# EAGLE design ManitoBoardLP1 (EAGLE 7.2.0)
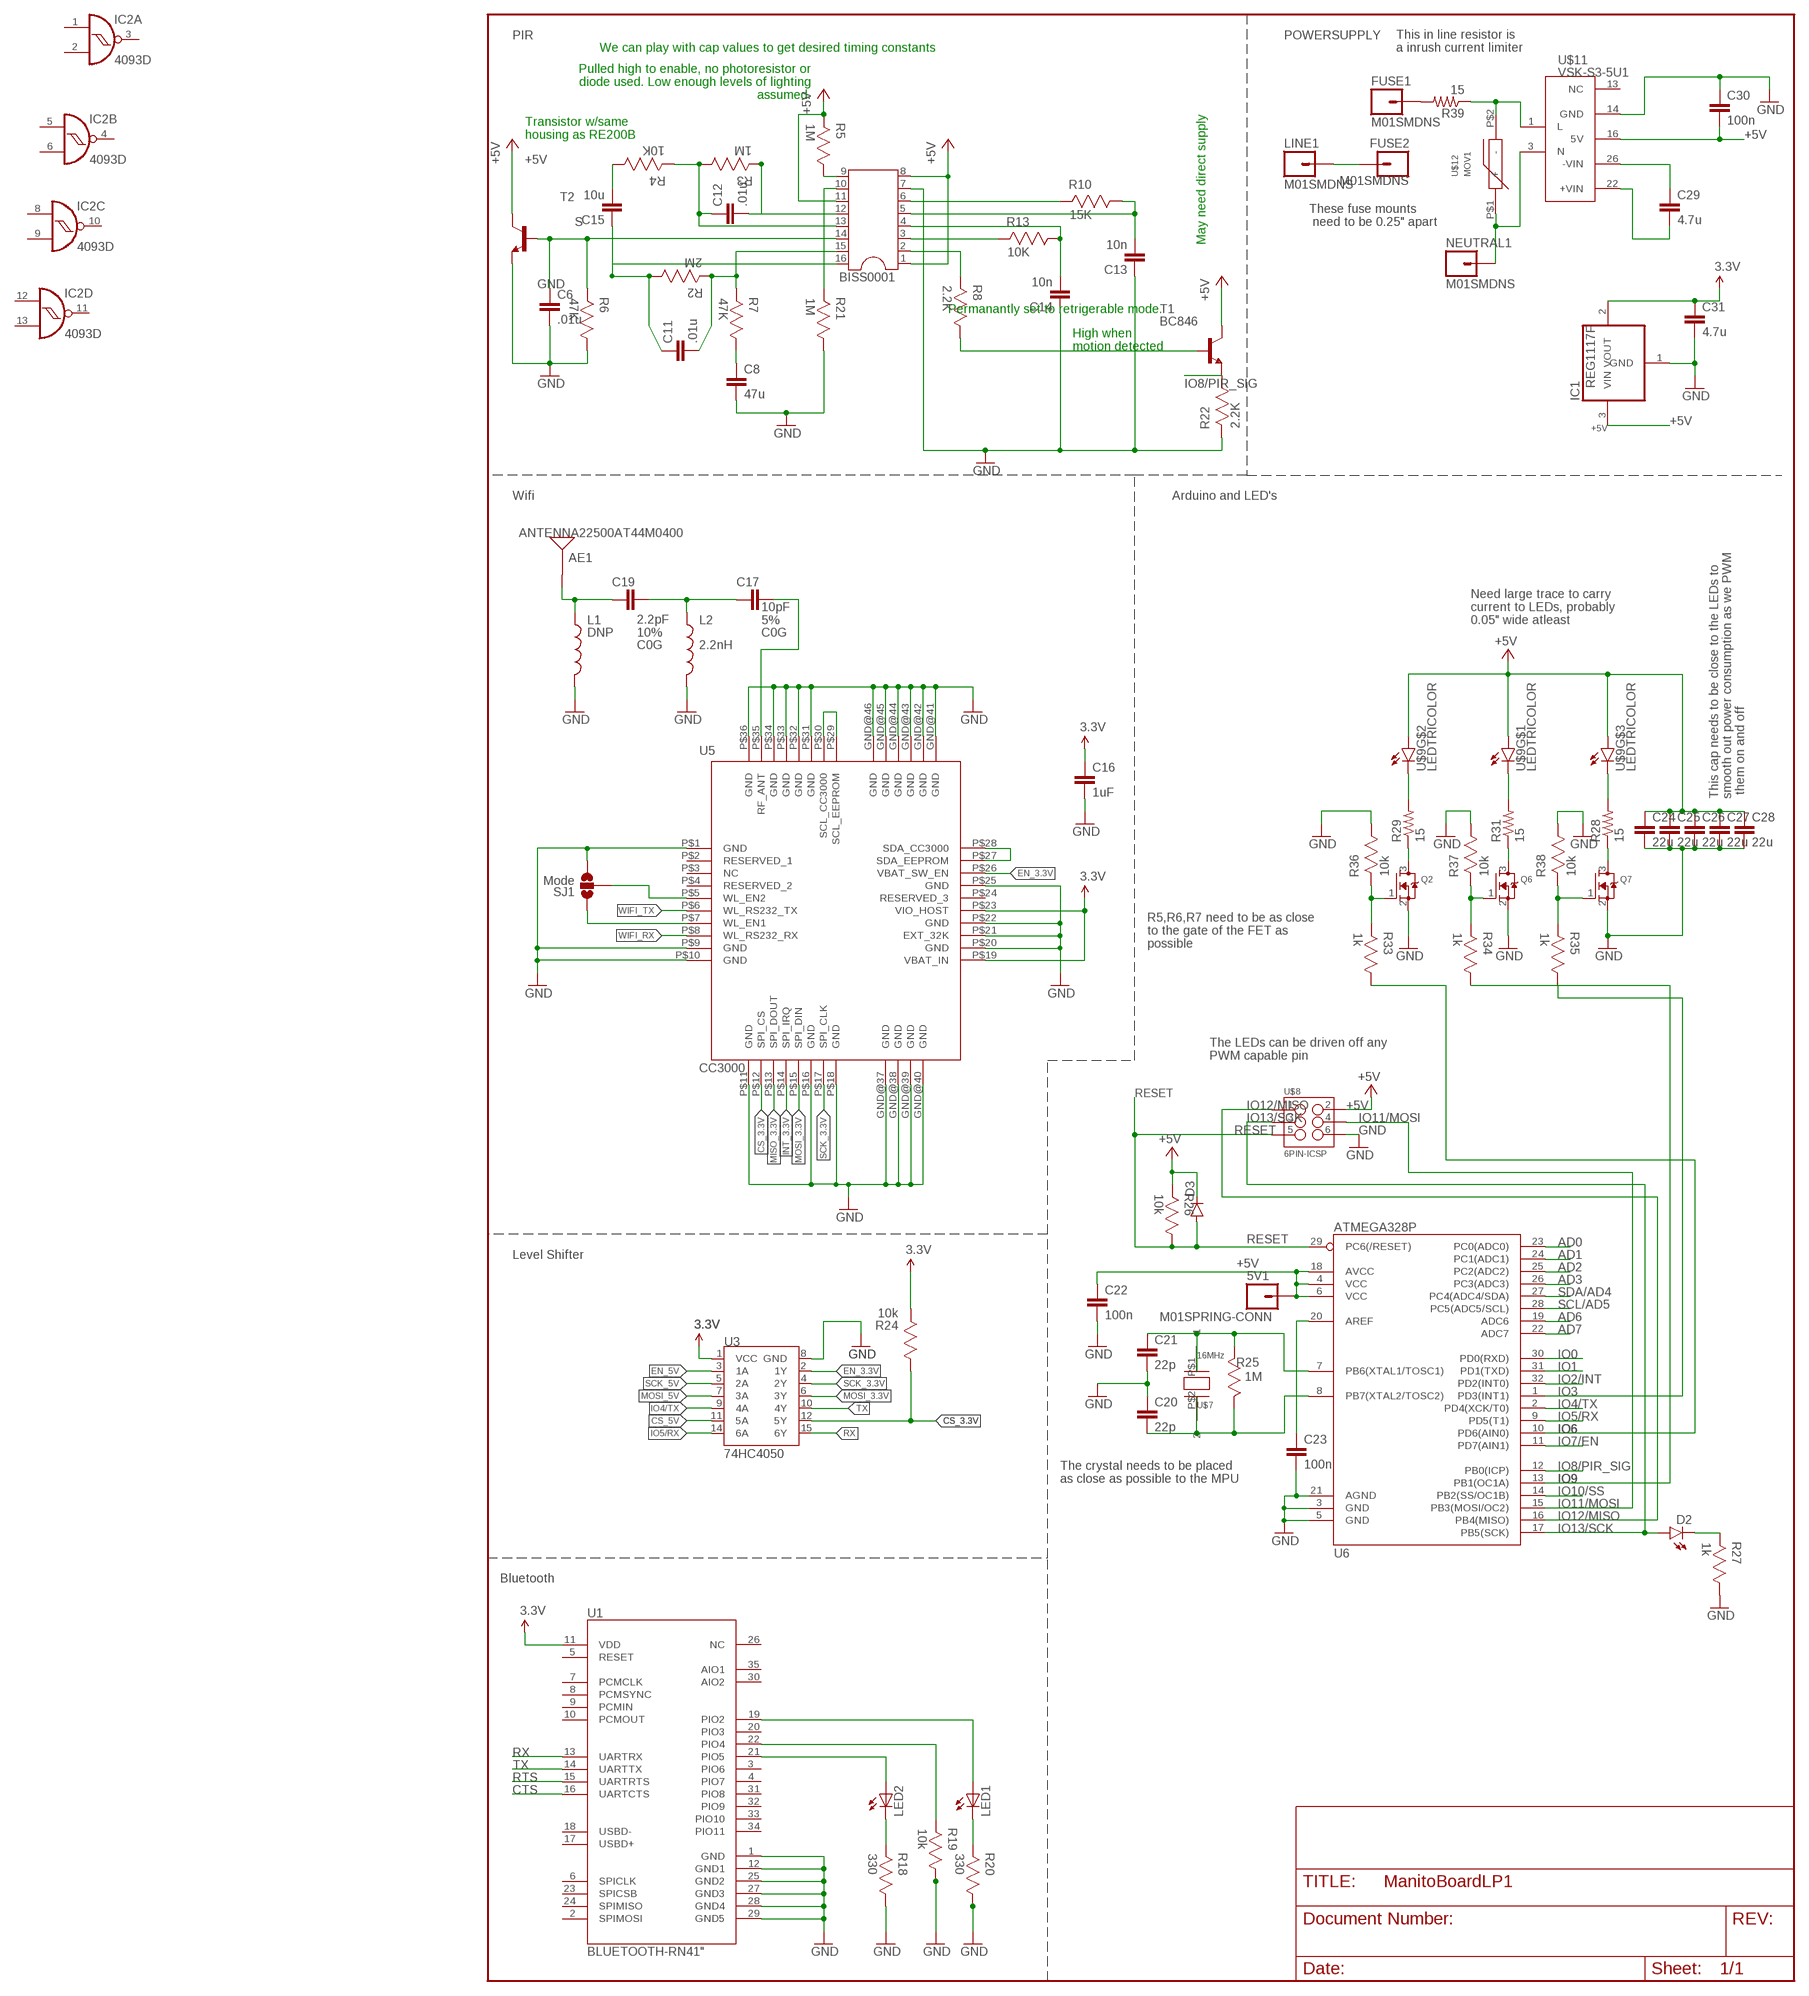
[diagram p0: schematic, sheet 1]

## Parts
5V1  M01SPRING-CONN  [SPRING-CONNECTOR]
AE1  ANTENNA22500AT44M0400  [ANTENNA-CHIP_2500AT44M0400]
BISS0001  DIL16S  [SOCKET-16]
C6  .01u  CAP0805  [0805]
C8  47u  CAP0805  [0805]
C11  .01u  CAP0805  [0805]
C12  .01u  CAP0805  [0805]
C13  10n  CAP0805  [0805]
C14  10n  CAP0805  [0805]
C15  10u  CAP0805  [0805]
C16  1uF  CAP0805  [0805]
C17  10pF  CAP0603-CAP  [0603-CAP]
C19  2.2pF  CAP0603-CAP  [0603-CAP]
C20  22p  CAP0603-CAP  [0603-CAP]
C21  22p  CAP0603-CAP  [0603-CAP]
C22  100n  CAP0603-CAP  [0603-CAP]
C23  100n  CAP0603-CAP  [0603-CAP]
C24  22u  CAP0603-CAP  [0603-CAP]
C25  22u  CAP0603-CAP  [0603-CAP]
C26  22u  CAP0603-CAP  [0603-CAP]
C27  22u  CAP0603-CAP  [0603-CAP]
C28  22u  CAP0603-CAP  [0603-CAP]
C29  4.7u  CAP0603-CAP  [0603-CAP]
C30  100n  CAP0603-CAP  [0603-CAP]
C31  4.7u  CAP0603-CAP  [0603-CAP]
D2  LED-YELLOW0603  [LED-0603]
D3  DIODE1N4148  [DIODE-1N4148]
FUSE1  M01SMDNS  [1X01NS]
FUSE2  M01SMDNS  [1X01NS]
IC1  REG1117F  [DD-3]
IC2  4093D  [SO14]
L1  DNP  INDUCTOR0603  [0603]
L2  2.2nH  INDUCTOR0603  [0603]
LED1  LED_ESML0603  [LED_SML0603]
LED2  LED_ESML0603  [LED_SML0603]
LINE1  M01SMDNS  [1X01NS]
NEUTRAL1  M01SMDNS  [1X01NS]
Q2  MOSFET-NREFLOW  [SOT23]
Q6  MOSFET-NREFLOW  [SOT23]
Q7  MOSFET-NREFLOW  [SOT23]
R2  2M  0603RESISTOR1  [0603RESISTOR]
R3  1M  0603RESISTOR1  [0603RESISTOR]
R4  10K  0603RESISTOR1  [0603RESISTOR]
R5  1M  0603RESISTOR1  [0603RESISTOR]
R6  47K  0603RESISTOR1  [0603RESISTOR]
R7  47K  0603RESISTOR1  [0603RESISTOR]
R8  2.2K  0603RESISTOR1  [0603RESISTOR]
R10  15K  0603RESISTOR1  [0603RESISTOR]
R13  10K  0603RESISTOR1  [0603RESISTOR]
R18  330  0603RESISTOR1  [0603RESISTOR]
R19  10k  0603RESISTOR1  [0603RESISTOR]
R20  330  0603RESISTOR1  [0603RESISTOR]
R21  1M  0603RESISTOR1  [0603RESISTOR]
R22  2.2K  0603RESISTOR1  [0603RESISTOR]
R24  10k  0603RESISTOR1  [0603RESISTOR]
R25  1M  0603RESISTOR1  [0603RESISTOR]
R26  10k  0603RESISTOR1  [0603RESISTOR]
R27  1k  0603RESISTOR1  [0603RESISTOR]
R28  15  RESISTORPTH-1W  [AXIAL-0.6]
R29  15  RESISTORPTH-1W  [AXIAL-0.6]
R31  15  RESISTORPTH-1W  [AXIAL-0.6]
R33  1k  0603RESISTOR1  [0603RESISTOR]
R34  1k  0603RESISTOR1  [0603RESISTOR]
R35  1k  0603RESISTOR1  [0603RESISTOR]
R36  10k  0603RESISTOR1  [0603RESISTOR]
R37  10k  0603RESISTOR1  [0603RESISTOR]
R38  10k  0603RESISTOR1  [0603RESISTOR]
R39  15  RESISTORPTH-1W  [AXIAL-0.6]
SJ1  Mode  SOLDERJUMPER_2WAYPASTE1&2  [SJ_3_PASTE1&2]
T1  BC846  [SOT23]
T2  -NPN-TO5  [TO5]
U1  BLUETOOTH-RN41"  [RN41]
U3  74HC4050  HEX_CONVERTER  [SO016]
U5  CC3000  [QFN-46_CC3000]
U6  ATMEGA328P  ATMEGA328_SMT  [TQFP32-08]
U$7  16MHz  SMDCRYSTAL  [SMDCRYSTAL]
U$8  6PIN-ICSP  [2X3-ICSP]
U$9  LEDTRICOLOR  [TRICOLORLED]
U$11  VSK-S3-5U1  [VSK-S3-DCAC]
U$12  MOV1  [MOV]

## Nets
3.3V: C16.1 C31.1 IC1.2(VOUT) R24.2 U1.11(VDD) U3.1(VCC) U5.P$19(VBAT_IN) U5.P$23(VIO_HOST)
+5V [usbvcc]: 5V1.P$2 BISS0001.1 BISS0001.8 BISS0001.11 C22.1 C24.1 C25.1 C26.1 C27.1 C28.1 C30.2 D3.C IC1.3(VIN) R5.2 R26.2 T1.3(C) T2.3(C) U6.4(VCC) U6.6(VCC) U6.18(AVCC) U$8.2(+5V) U$9.A1(A) U$9.A2(A) U$9.A3(A) U$11.16(5V)
AD0: U6.23(PC0(ADC0))
AD1: U6.24(PC1(ADC1))
AD2: U6.25(PC2(ADC2))
AD3: U6.26(PC3(ADC3))
AD6: U6.19(ADC6)
AD7: U6.22(ADC7)
CS_3.3V: R24.1 U3.12(5Y) U5.P$12(SPI_CS)
CS_5V: U3.11(5A)
CTS: U1.16(UARTCTS)
EN_3.3V: U3.2(1Y) U5.P$26(VBAT_SW_EN)
EN_5V: U3.3(1A)
GND: BISS0001.7 C6.2 C8.2 C13.1 C14.1 C16.2 C20.1 C21.2 C22.2 C23.2 C24.2 C25.2 C26.2 C27.2 C28.2 C30.1 C31.2 IC1.1(GND) L1.2 L2.2 Q2.2(S) Q6.2(S) Q7.2(S) R6.1 R18.1 R19.1 R20.1 R21.1 R22.2 R27.1 R36.1 R37.1 R38.1 SJ1.3 T2.1(E) U1.1(GND) U1.12(GND1) U1.25(GND2) U1.27(GND3) U1.28(GND4) U1.29(GND5) U3.8(GND) U5.GND@37(GND) U5.GND@38(GND) U5.GND@39(GND) U5.GND@40(GND) U5.GND@41(GND) U5.GND@42(GND) U5.GND@43(GND) U5.GND@44(GND) U5.GND@45(GND) U5.GND@46(GND) U5.P$1(GND) U5.P$9(GND) U5.P$10(GND) U5.P$11(GND) U5.P$16(GND) U5.P$18(GND) U5.P$20(GND) U5.P$21(EXT_32K) U5.P$22(GND) U5.P$25(GND) U5.P$31(GND) U5.P$32(GND) U5.P$33(GND) U5.P$34(GND) U5.P$36(GND) U6.3(GND) U6.5(GND) U6.21(AGND) U$8.6(GND) U$11.14(GND)
INT_3.3V: U5.P$14(SPI_IRQ)
IO0: U6.30(PD0(RXD))
IO1: U6.31(PD1(TXD))
IO2/INT: U6.32(PD2(INT0))
IO3: R35.1 U6.1(PD3(INT1))
IO4/TX: U3.9(4A) U6.2(PD4(XCK/T0))
IO5/RX: U3.14(6A) U6.9(PD5(T1))
IO6: R33.1 U6.10(PD6(AIN0))
IO7/EN: U6.11(PD7(AIN1))
IO8/PIR_SIG: R22.1 T1.2(E) U6.12(PB0(ICP))
IO9: R34.1 U6.13(PB1(OC1A))
IO10/SS: U6.14(PB2(SS/OC1B))
IO11/MOSI: U6.15(PB3(MOSI/OC2)) U$8.4(MOSI)
IO12/MISO: U6.16(PB4(MISO)) U$8.1(MISO)
IO13/SCK: D2.A U6.17(PB5(SCK)) U$8.3(SCK)
MISO_3.3V: U5.P$13(SPI_DOUT)
MOSI_3.3V: U3.6(3Y) U5.P$15(SPI_DIN)
MOSI_5V: U3.7(3A)
N$1: BISS0001.9 R5.1
N$3: LED2.C R18.2
N$14: BISS0001.16 C11.1 C15.1 R2.1
N$15: BISS0001.15 C11.2 R2.2 R7.2
N$16: BISS0001.13 C12.1 R3.1 R4.2
N$20: LED1.C R20.2
N$26: BISS0001.12 C12.2 R3.2
N$27: C8.1 R7.1
N$32: LED2.A U1.21(PIO5)
N$33: R19.2 U1.22(PIO4)
N$34: LED1.A U1.19(PIO2)
N$35: BISS0001.10 R21.2
N$36: C15.2 R4.1
N$37: BISS0001.6 R10.2
N$38: BISS0001.5 C13.2 R10.1
N$39: BISS0001.4 C14.2 R13.1
N$40: BISS0001.3 R13.2
N$41: BISS0001.2 R8.2
N$42: R8.1 T1.1(B)
N$43: SJ1.2 U5.P$5(WL_EN2)
N$44: SJ1.1 U5.P$7(WL_EN1)
N$45: U5.P$27(SDA_EEPROM) U5.P$28(SDA_CC3000)
N$46: U5.P$29(SCL_EEPROM) U5.P$30(SCL_CC3000)
N$47: C17.1 C19.2 L2.1
N$48: AE1.FEED(SIGNAL) C19.1 L1.1
N$50: C17.2 U5.P$35(RF_ANT)
N$53: C20.2 R25.1 U6.8(PB7(XTAL2/TOSC2)) U$7.P$2
N$54: C21.1 R25.2 U6.7(PB6(XTAL1/TOSC1)) U$7.P$1
N$55: C23.1 U6.20(AREF)
N$56: D2.C R27.2
N$57: R29.P$2 U$9.C2(C)
N$58: R31.P$2 U$9.C1(C)
N$59: R28.P$2 U$9.C3(C)
N$60: Q7.3(D) R28.P$1
N$61: Q6.3(D) R31.P$1
N$62: Q2.3(D) R29.P$1
N$63: Q2.1(G) R33.2 R36.2
N$64: Q7.1(G) R35.2 R38.2
N$65: Q6.1(G) R34.2 R37.2
N$68: C29.1 U$11.26(-VIN)
N$69: C29.2 U$11.22(+VIN)
N$70: R39.P$1 U$11.1(L) U$12.P$2(-)
N$71: NEUTRAL1.1 U$11.3(N) U$12.P$1(+)
N$72: FUSE2.1 LINE1.1
N$73: FUSE1.1 R39.P$2
RESET: D3.A R26.1 U6.29(PC6(/RESET)) U$8.5(RESET)
RTS: U1.15(UARTRTS)
RX: U1.13(UARTRX) U3.15(6Y)
S: BISS0001.14 C6.1 R6.2 T2.2(B)
SCK_3.3V: U3.4(2Y) U5.P$17(SPI_CLK)
SCK_5V: U3.5(2A)
SCL/AD5: U6.28(PC5(ADC5/SCL))
SDA/AD4: U6.27(PC4(ADC4/SDA))
TX: U1.14(UARTTX) U3.10(4Y)
WIFI_RX: U5.P$8(WL_RS232_RX)
WIFI_TX: U5.P$6(WL_RS232_TX)
Unconnected: IC2.1(A:I0) IC2.2(A:I1) IC2.3(A:O) IC2.4(B:O) IC2.5(B:I0) IC2.6(B:I1) IC2.8(C:I0) IC2.9(C:I1) IC2.10(C:O) IC2.11(D:O) IC2.12(D:I0) IC2.13(D:I1) U1.2(SPIMOSI) U1.3(PIO6) U1.4(PIO7) U1.5(RESET) U1.6(SPICLK) U1.7(PCMCLK) U1.8(PCMSYNC) U1.9(PCMIN) U1.10(PCMOUT) U1.17(USBD+) U1.18(USBD-) U1.20(PIO3) U1.23(SPICSB) U1.24(SPIMISO) U1.26(NC) U1.30(AIO2) U1.31(PIO8) U1.32(PIO9) U1.33(PIO10) U1.34(PIO11) U1.35(AIO1) U5.P$2(RESERVED_1) U5.P$3(NC) U5.P$4(RESERVED_2) U5.P$24(RESERVED_3) U$11.13(NC)

## Notes on the sheet
- PIR
- We can play with cap values to get desired timing constants
- This in line resistor is 
  a inrush current limiter
- Pulled high to enable, no photoresistor or
   diode used. Low enough levels of lighting
   assumed.
- May need direct supply
- Transistor w/same 
  housing as RE200B
- These fuse mounts
   need to be 0.25" apart
- Permanantly set to retrigerable mode.
- High when 
  motion detected
- Wifi | Arduino and LED's
- Need large trace to carry
  current to LEDs, probably
  0.05" wide atleast
- This cap needs to be close to the LEDs to 
  smooth out power consumption as we PWM
   them on and off
- R5,R6,R7 need to be as close
  to the gate of the FET as
  possible
- The LEDs can be driven off any
  PWM capable pin
- Level Shifter
- The crystal needs to be placed
  as close as possible to the MPU
- Bluetooth

## Power pins joined to a net without a drawn wire
VDD: IC2.14(P:VDD)
VSS: IC2.7(P:VSS)

## Library data of the parts
5V1 FUSE1 FUSE2 LINE1 NEUTRAL1 = CharlieCreations:M01: Header 1 Standard 1-pin 0.1" header. Use with straight break away headers (SKU : PRT-00116), right angle break away headers (PRT-00553), swiss pins (PRT-00743), machine pins (PRT-00117), and female headers (PRT-00115).
AE1 = SparkFun-RF:ANTENNA2: Chip antenna Single endded antenna. Common with smaller chip antennas. CHIP4 package is the GPS Chip Antenna SKU: GPS-08418. CHIP5 package is 2.4GHz chip antenna SKU: WRL-00144.
BISS0001 = ic-package:DIL16: Dual In Line / Socket
C6 C8 C11-C15 C20-C31 = CharlieCreations:CAP: Capacitor Standard 0603 ceramic capacitor, and 0.1" leaded capacitor.
C16 = SparkFun-Capacitors:CAP: Capacitor Standard 0603 ceramic capacitor, and 0.1" leaded capacitor.
C17 = SparkFun-Capacitors:CAP: Capacitor Standard 0603 ceramic capacitor, and 0.1" leaded capacitor.; COEFF: C0G; TOL: 5%
C19 = SparkFun-Capacitors:CAP: Capacitor Standard 0603 ceramic capacitor, and 0.1" leaded capacitor.; COEFF: C0G; TOL: 10%
D2 = CharlieCreations:LED-YELLOW: Yellow SMD LEDs LilyPad 1206- DIO-09909 0603- DIO-09003; PROD_ID: DIO-09003
D3 = CharlieCreations:DIODE: Diode These are standard reverse protection diodes and small signal diodes. SMA package can handle up to about 1A. SOD-323 can handle about 200mA. What the SOD-323 package when ordering, there are some mfgs out there that are 5-pin packages.
IC1 = burr-brown:REG1117: 800mA and 1A Low Dropout (LDO) Positive Regulator 1.8V, 2.5V, 2.85V, 3.3V, 5V, and Adj; MF: TEXAS INSTRUMENTS; MPN: REG1117FAKTTT; OC_FARNELL: 1296120; OC_NEWARK: 87H2562
IC2 = adafruit:4093: Quad 2-input NAND schmitt trigger
L1 L2 = SparkFun-Passives:INDUCTOR: Inductors Basic Inductor/Choke - 0603 and 1206. Footprints are not proven and vary greatly between part numbers. SRN6045- 33uH, 20% 1.4A
LED1 LED2 = eagle-ltspice:LED_E: LED Source: http://www.osram.convergy.de Source: www.luxeon.com Source: www.kingbright.com; SPICEMODEL: NONE; SPICEPREFIX: D; SPICETYPE: diode
Q2 Q6 Q7 = CharlieCreations:MOSFET-N: N-Channel Mosfet 2N7002E - 60V 260mA SOT23 [Digikey: 2N7002ET1GOSTR-ND] - REEL BSH103 - 30V 850mA SOT23 [Digikey: 568-5013-1-ND]
R2-R8 R10 R13 R18-R22 R24-R27 R33-R38 = CharlieCreations:0603RESISTOR: RESISTOR, 0603; MPN: CRCW06031K21FKEA; OC_FARNELL: 1652852; OC_NEWARK: 52K8027; SUPPLIER: Vishay; TOLERANCE: ± 1.0 %; VALUE: 0; WATTAGE: 0.1W
R28 R29 R31 R39 = SparkFun-Passives:RESISTOR: Resistor Basic schematic elements and footprints for 0603, 1206, and PTH resistors.
SJ1 = SparkFun-Passives:SOLDERJUMPER_2WAY: Solder Jumper 2 way solder jumper
T1 = CharlieCreations:BC846: NPN TRANSISTOR
T2 = transistor:*-NPN-: NPN Transistror BF959 corrected 2008.03.06
U1 = SparkFun:BLUETOOTH-RN41
U3 = SparkFun-DigitalIC:HEX_CONVERTER: Just what it says.
U5 = SparkFun-RF:CC3000: TI CC3000 WiFi Module
U6 = CharlieCreations:ATMEGA328_SMT: 32-Pin Atmega328 part Commonly used on Arduino compatible boards Available in QFP and QFN packages TQFP is IC-09069 QFN is non-stock; PROD_ID: IC-09069
U$7 = CharlieCreations:SMDCRYSTAL
U$8 = CharlieCreations:6PIN-ICSP
U$9 = CharlieCreations:LEDTRICOLOR
U$11 = CharlieCreations:VSK-S3-5U: Universal AC to DC adapter, 5V Output, Manufacturer: CUI Inc
U$12 = CharlieCreations:MOV

## Net classes
2 gnd: width 0.305 mm, drill 0.559 mm, clearance 0.254 mm
3 usbvcc: width 0.508 mm, drill 0.61 mm, clearance 0.254 mm

## Board
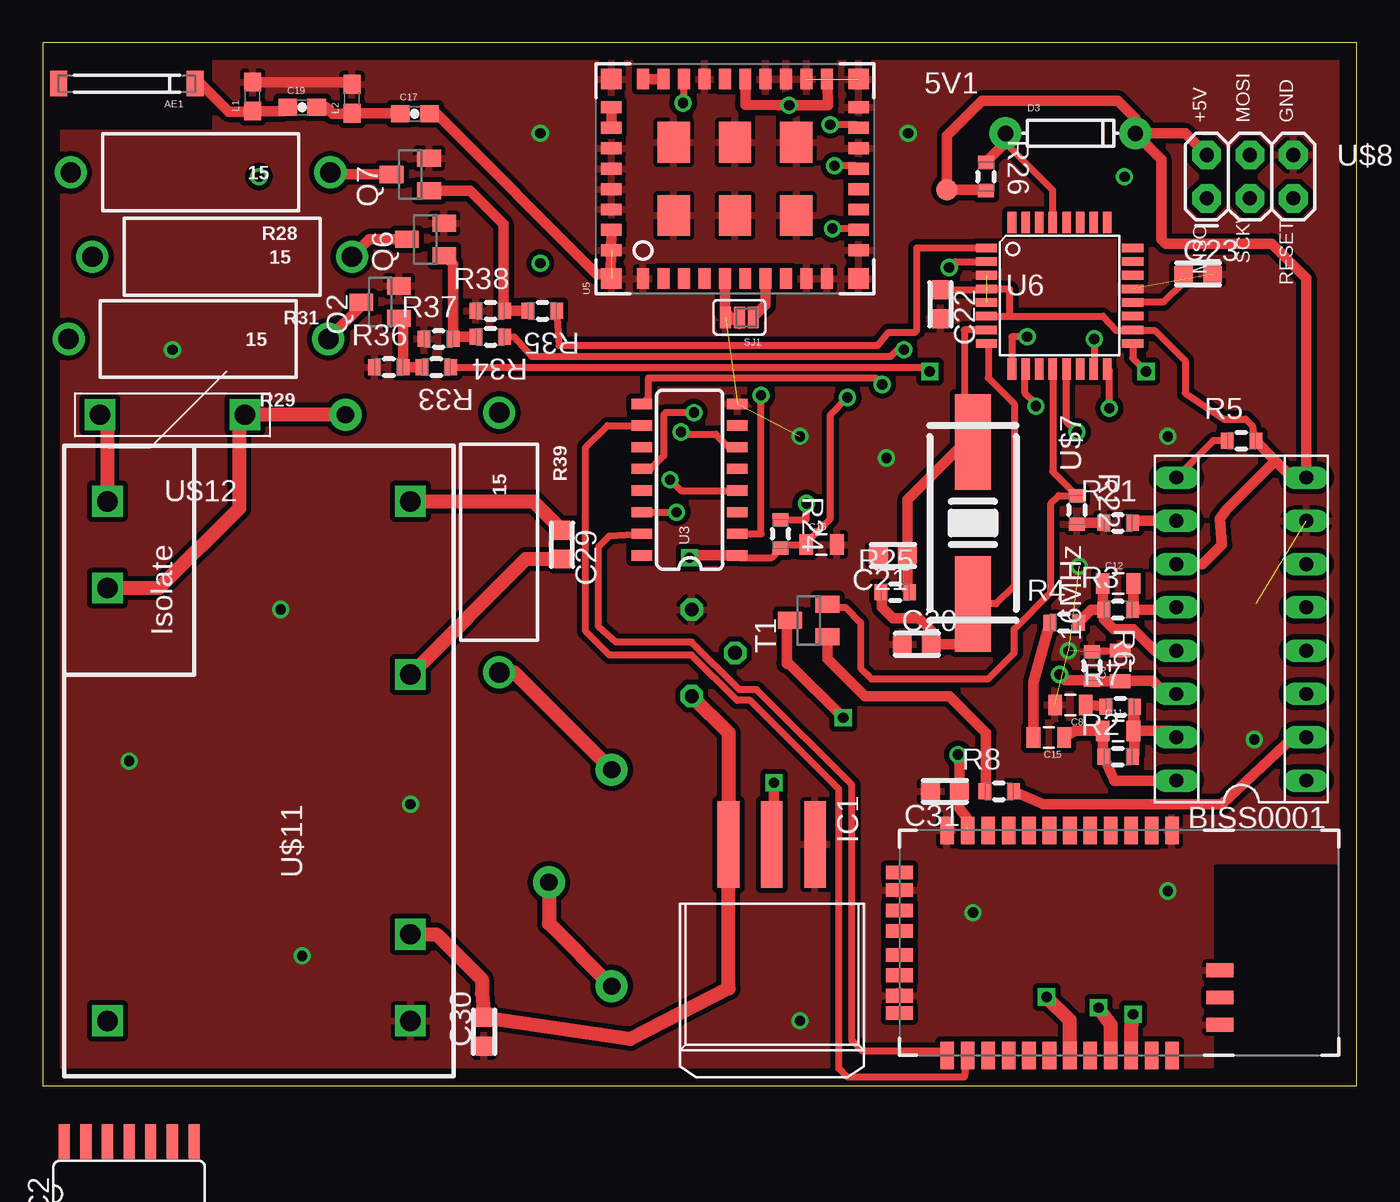
[diagram p1: board, top side]
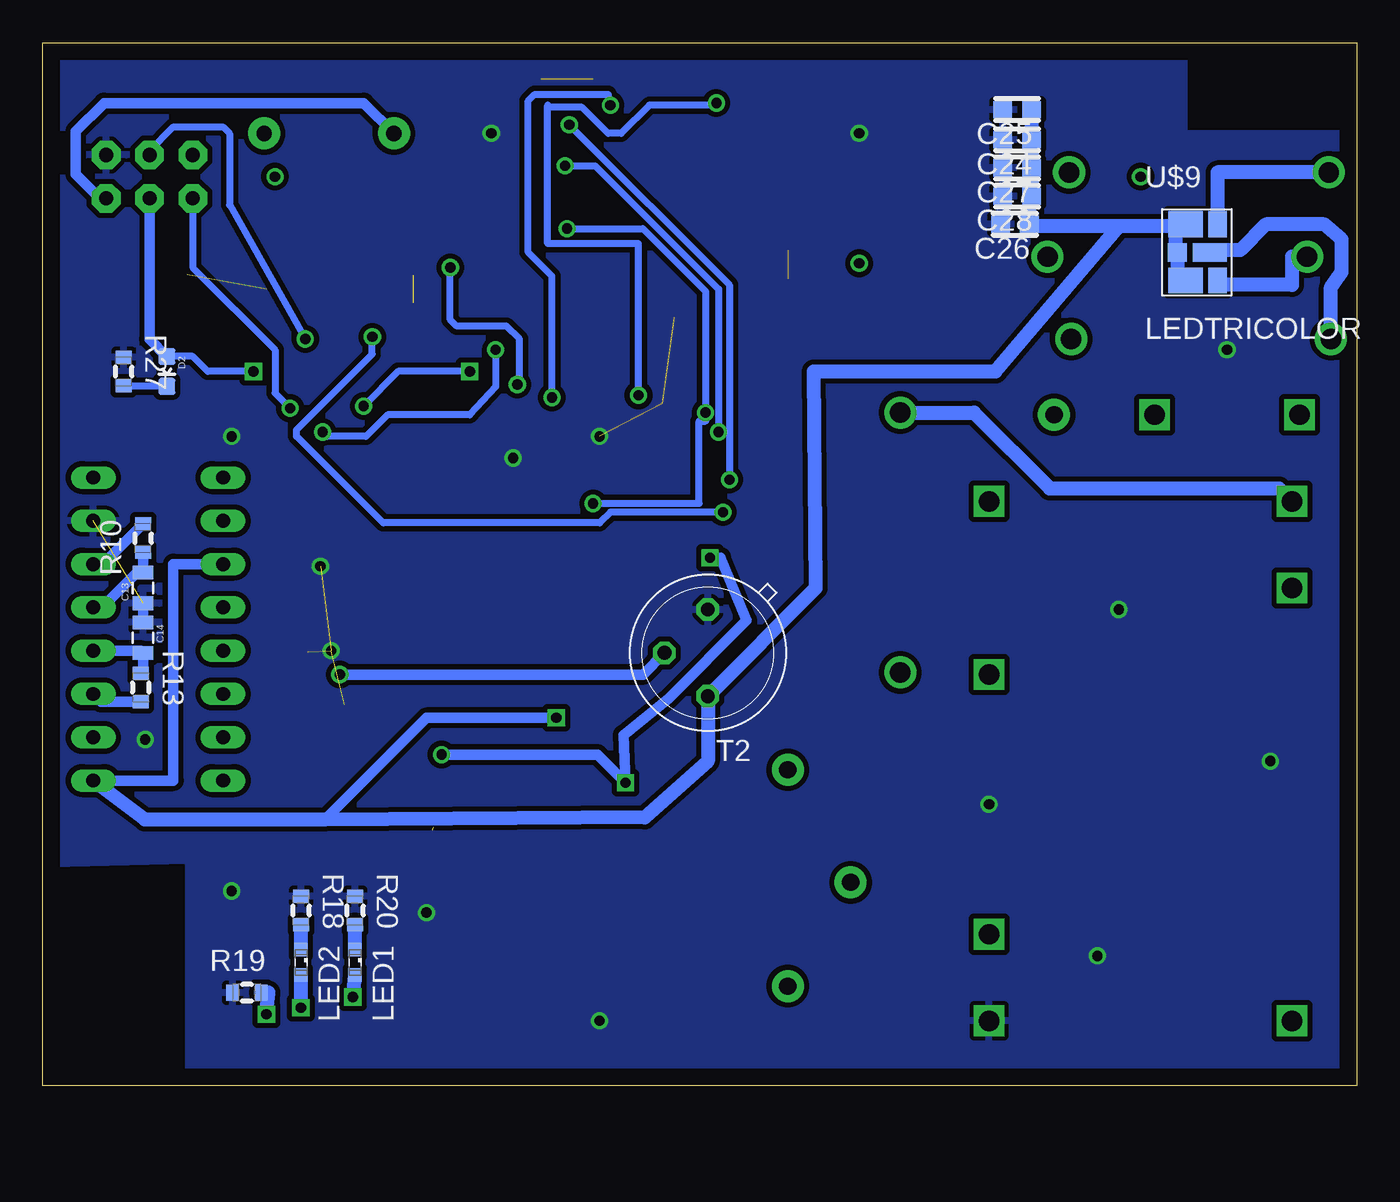
[diagram p2: board, bottom side, seen from below]

Size 77.14 x 61.2 mm. Coordinates in mm from the lower left corner, seen from the top.
Outline: 0,0 77.14,0 77.14,61.2 0,61.2 0,0
Copper layers (1*16): Top 0.035mm / dielectric 1.5mm / Bottom 0.035mm
Design rules "default": minimum track width 10mil, minimum drill 24mil, track to track 8mil, track to pad 8mil, pad to pad 8mil, via to via 8mil, smd to smd 8mil, copper to edge 40mil, drill to drill 8mil, minimum pad ring 10mil, minimum via ring 8mil, stop-mask expansion 4mil, vias tented up to drill 0mil, thermal gap 10mil

### Footprints (pad centres in the part's own frame; a part is rotated, then mirrored left to right if it is on the bottom)
SPRING-CONNECTOR = smd 1.27 x 1.27: P$2 0,0
ANTENNA-CHIP_2500AT44M0400 = smd 1 x 1.5: FEED -4,0; NC 4,0
SOCKET-16 = drill 0.813 long: 1 -8.89,-3.81; 2 -6.35,-3.81; 3 -3.81,-3.81; 4 -1.27,-3.81; 5 1.27,-3.81; 6 3.81,-3.81; 7 6.35,-3.81; 8 8.89,-3.81; 9 8.89,3.81; 10 6.35,3.81; 11 3.81,3.81; 12 1.27,3.81; 13 -1.27,3.81; 14 -3.81,3.81; 15 -6.35,3.81; 16 -8.89,3.81
0805 = smd 0.8 x 1.2: 1 -0.9,0; 2 0.9,0
0603-CAP = smd 1.1 x 1: 1 -0.85,0; 2 0.85,0
LED-0603 = smd 1 x 1: A 0,-0.877; C 0,0.877
DIODE-1N4148 = drill 0.9 pad 1.88: A -3.81,0; C 3.81,0
1X01NS = drill 1.016 pad 1.88: 1 0,0
DD-3 = smd 1.27 x 5.08: 1 -2.54,-7.938; 2 0,-7.938; 3 2.54,-7.938
SO14 = smd 0.66 x 2.032: 1 -3.81,-3.073; 2 -2.54,-3.073; 3 -1.27,-3.073; 4 0,-3.073; 5 1.27,-3.073; 6 2.54,-3.073; 7 3.81,-3.073; 8 3.81,3.073; 9 2.54,3.073; 10 1.27,3.073; 11 0,3.073; 12 -1.27,3.073; 13 -2.54,3.073; 14 -3.81,3.073
0603 = smd 1.1 x 1: 1 -0.85,0; 2 0.85,0
LED_SML0603 = smd 0.8 x 0.8: A 0.75,0; C -0.75,0
SOT23 = smd 1 x 1.4: 1 -0.95,-1.1; 2 0.95,-1.1; 3 0,1.1
0603RESISTOR = smd 0.762 x 0.94: 1 -0.838,0; 2 0.838,0
AXIAL-0.6 = drill 1.2 pad 1.88: P$1 -7.62,0; P$2 7.62,0
SJ_3_PASTE1&2 = smd 0.635 x 1.27: 1 -0.813,0; 2 0,0; 3 0.813,0
TO5 = drill 0.813 octagon: 1 0,-2.54; 2 2.54,0; 3 0,2.54
RN41 = smd 0.8 x 1.6: 1 -6.6,-6.6; 2 -5.4,-6.6; 3 -4.2,-6.6; 4 -3,-6.6; 5 -1.8,-6.6; 6 -0.6,-6.6; 7 0.6,-6.6; 8 1.8,-6.6; 9 3,-6.6; 10 4.2,-6.6; 11 5.4,-6.6; 12 6.6,-6.6; 13 6.6,6.6; 14 5.4,6.6; 15 4.2,6.6; 16 3,6.6; 17 1.8,6.6; 18 0.6,6.6; 19 -0.6,6.6; 20 -1.8,6.6; 21 -3,6.6; 22 -4.2,6.6; 23 -5.4,6.6; 24 -6.6,6.6 | smd 1.6 x 0.8: 25 -9.4,4.8; 26 -9.4,3.2; 27 -9.4,1.6; 28 9.4,3.1; 29 9.4,-3.1; 30 9.4,-4.122; 31 9.4,-1.9; 32 9.4,-0.7; 33 9.4,0.7; 34 9.4,1.9; 35 9.4,4.122
SO016 = smd 0.6 x 1.2: 1 -4.445,-2.8; 2 -3.175,-2.8; 3 -1.905,-2.8; 4 -0.635,-2.8; 5 0.635,-2.8; 6 1.905,-2.8; 7 3.175,-2.8; 8 4.445,-2.8; 9 4.445,2.8; 10 3.175,2.8; 11 1.905,2.8; 12 0.635,2.8; 13 -0.635,2.8; 14 -1.905,2.8; 15 -3.175,2.8; 16 -4.445,2.8
QFN-46_CC3000 = smd 2.4 x 1.9: GND@37 -2.15,3.6; GND@38 -2.15,0; GND@39 -2.15,-3.6; GND@40 2.15,3.6; GND@41 2.15,0; GND@42 2.15,-3.6 | smd 1.2 x 1.2: GND@43 -5.85,7.25; GND@44 -5.85,-7.25; GND@45 5.85,-7.25; GND@46 5.85,7.25 | smd 1.2 x 0.7: P$1 -5.85,5.4; P$2 -5.85,4.2; P$3 -5.85,3; P$4 -5.85,1.8; P$5 -5.85,0.6; P$6 -5.85,-0.6; P$7 -5.85,-1.8; P$8 -5.85,-3; P$9 -5.85,-4.2; P$10 -5.85,-5.4; P$19 5.85,-5.4; P$20 5.85,-4.2; P$21 5.85,-3; P$22 5.85,-1.8; P$23 5.85,-0.6; P$24 5.85,0.6; P$25 5.85,1.8; P$26 5.85,3; P$27 5.85,4.2; P$28 5.85,5.4 | smd 0.7 x 1.2: P$11 -4.2,-7.25; P$12 -3,-7.25; P$13 -1.8,-7.25; P$14 -0.6,-7.25; P$15 0.6,-7.25; P$16 1.8,-7.25; P$17 3,-7.25; P$18 4.2,-7.25; P$29 4.2,7.25; P$30 3,7.25; P$31 1.8,7.25; P$32 0.6,7.25; P$33 -0.6,7.25; P$34 -1.8,7.25; P$35 -3,7.25; P$36 -4.2,7.25
TQFP32-08 = smd 1.25 x 0.5: 1 -4.293,2.8; 2 -4.293,2; 3 -4.293,1.2; 4 -4.293,0.4; 5 -4.293,-0.4; 6 -4.293,-1.2; 7 -4.293,-2; 8 -4.293,-2.8; 17 4.293,-2.8; 18 4.293,-2; 19 4.293,-1.2; 20 4.293,-0.4; 21 4.293,0.4; 22 4.293,1.2; 23 4.293,2; 24 4.293,2.8 | smd 0.5 x 1.25: 9 -2.8,-4.293; 10 -2,-4.293; 11 -1.2,-4.293; 12 -0.4,-4.293; 13 0.4,-4.293; 14 1.2,-4.293; 15 2,-4.293; 16 2.8,-4.293; 25 2.8,4.293; 26 2,4.293; 27 1.2,4.293; 28 0.4,4.293; 29 -0.4,4.293; 30 -1.2,4.293; 31 -2,4.293; 32 -2.8,4.293
SMDCRYSTAL = smd 5.588 x 2.108: P$1 -4.75,0; P$2 4.75,0
2X3-ICSP = drill 0.826 pad 1.676 octagon: 1 -2.54,-1.27; 2 -2.54,1.27; 3 0,-1.27; 4 0,1.27; 5 2.54,-1.27; 6 2.54,1.27
TRICOLORLED = smd 2.007 x 1.499: A1 -0.152,-1.651; A3 -0.152,1.651 | smd 1.092 x 1.092: A2 -0.635,0 | smd 1.092 x 1.499: C1 1.727,-1.651; C3 1.727,1.651 | smd 2.007 x 1.092: C2 1.27,0
VSK-S3-DCAC = drill 1.2 square: 1 -15.24,-7.62; 3 -10.16,-7.62; 13 15.24,-7.62; 14 15.24,10.16; 16 10.16,10.16; 22 -5.08,10.16; 26 -15.24,10.16
MOV = drill 1.2 square: P$1 -4.255,0; P$2 4.255,0

### Placement (x,y rotation side)
5V1  53.09,52.58 0 top
AE1  4.95,58.8 180 top
BISS0001  70.36,26.8 90 top
C6  63.25,24.64 90 top
C8  60.33,22.35 180 top
C11  63.12,20.83 0 top
C12  63.12,29.46 0 top
C13  71.25,29.21 90 bottom
C14  71.25,26.29 270 bottom
C15  59.05,20.45 180 top
C16  45.72,31.75 0 top
C17  21.84,57.02 0 top
C19  15.24,57.4 0 top
C20  51.31,25.91 0 top
C21  49.91,31.11 180 top
C22  52.7,45.85 270 top
C23  67.82,47.62 0 top
C24  19.94,55.5 180 bottom
C25  19.94,57.28 180 bottom
C26  20.07,50.55 180 bottom
C27  19.94,53.85 180 bottom
C28  19.94,52.2 180 bottom
C29  30.48,31.75 270 top
C30  25.91,3.17 90 top
C31  52.96,17.27 180 top
D2  69.85,41.91 180 bottom
D3  60.33,55.88 0 top
FUSE1  33.4,18.54 0 top
FUSE2  33.4,5.84 0 top
IC1  42.8,6.22 180 top
IC2  5.08,-6.35 0 top  (outside the outline)
L1  12.32,58.04 90 top
L2  18.16,57.91 90 top
LED1  58.8,7.24 270 bottom
LED2  61.98,7.24 270 bottom
LINE1  29.72,11.94 0 top
NEUTRAL1  17.78,39.37 0 top
Q2  19.81,45.97 90 top
Q6  22.48,49.66 90 top
Q7  21.59,53.47 90 top
R2  63.12,19.3 0 top
R3  63.12,27.94 0 top
R4  59.94,27.18 0 top
R5  70.36,37.85 0 top
R6  61.59,24.64 270 top
R7  63.25,22.23 0 top
R8  56.13,17.27 0 top
R10  71.25,32.13 90 bottom
R13  71.37,23.37 270 bottom
R18  61.98,10.29 270 bottom
R19  65.15,5.46 0 bottom
R20  58.8,10.29 270 bottom
R21  63.12,33.02 0 top
R22  60.71,33.78 270 top
R24  43.31,32.38 270 top
R25  50.04,28.96 0 top
R26  55.37,53.34 270 top
R27  72.39,41.91 270 bottom
R28  9.27,53.59 180 top
R29  9.14,43.81 180 top
R31  10.54,48.64 180 top
R33  23.11,42.16 180 top
R34  26.29,43.94 180 top
R35  29.34,45.47 180 top
R36  20.32,42.16 0 top
R37  23.24,43.81 0 top
R38  26.29,45.47 0 top
R39  26.8,31.88 270 top
SJ1  40.89,45.09 180 top
T1  44.96,27.3 90 top
T2  38.1,25.4 180 bottom
U1  59.69,8.38 180 top
U3  37.97,35.56 90 top
U5  40.64,53.21 90 top
U6  59.69,46.35 0 top
U$7  54.61,33.02 270 top
U$8  70.87,53.34 0 top
U$9  9.91,48.9 0 bottom
U$11  11.43,19.05 270 top
U$12  7.62,39.37 180 top

### Tracks (layer width: path | path; a pad name or v marks a point on that pad's centre or on a via)
3.3V  (via drill 0.6)  (1 unrouted)
  Top 0.406: U3.1 40.9,30.99 42.8,30.99 43.31,31.5 R24.2 43.51,31.75 44.7,31.75 | 44.7,31.75 C16.1 | 44.7,31.75 46.23,33.27 46.23,39.37 v47.24,40.39 | v43.81,57.53 43.19,57.53
  Top 0.61: U5.P$23 41.24,57.57 43.19,57.53 43.31,57.53 v43.81,57.53 46.1,57.53 46.1,57.85 U5.P$19 | 54.23,15.17 54.23,15.75 53.81,16.3 C31.1 53.81,19.34 v53.72,19.43 | IC1.2 42.93,14.29 v42.93,17.78 | v37.97,30.99 38.1,31.11 U3.1
  Bottom 0.406: v47.24,40.39 47.24,47.5 48.64,48.9 48.64,57.78 48.26,58.17 43.94,58.17 43.94,57.66 v43.81,57.53
  Bottom 0.61: v53.72,19.43 44.58,19.43 v42.93,17.78 43.05,20.57 40.39,22.73 35.81,27.3 37.34,30.99 v37.97,30.99
+5V  (via drill 0.6)
  Top 0.406: 63.98,44.32 62.99,44.32 62.23,45.16 U6.6 56.77,45.16 56.77,46.74 55.4,46.74 U6.4 55.4,46.7 C22.1 | 63.98,44.32 U6.18 | 63.98,44.32 65.28,44.32 67.06,42.55 67.06,40.64 69.34,39.12 70.61,39.12 70.99,38.73 71.12,37.92 R5.2
  Top 0.61: 72.36,36.68 73.36,35.69 BISS0001.8 74.17,47.37 72.14,49.4 65.91,49.4 65.66,49.66 65.66,54.36 D3.C | 72.36,36.68 R5.2 | BISS0001.11 68.07,30.61 69.22,31.75 69.09,33.27 69.47,33.78 72.36,36.68 | U$8.2 67.06,55.88 D3.C | D3.C 64.14,56.77 63.12,57.78 55.12,57.78 53.09,55.75 5V1.P$2 55.3,52.58 R26.2 | T1.3 43.69,27.3 43.69,24.77 43.81,24.77 v46.99,21.59
  Top 0.813: U$11.16 23.11,8.89 25.78,6.22 25.78,5.42 C30.2 34.51,2.75 40.26,5.71 IC1.3 40.26,20.7 T2.3
  Bottom 0.61: BISS0001.1 69.47,17.91 69.47,30.61 BISS0001.11 | v46.99,21.59 54.61,21.59 60.58,15.62
  Bottom 0.813: U$9.A3 10.54,50.55 10.67,50.42 | 10.67,50.42 10.67,49.02 U$9.A2 10.54,47.73 U$9.A1 | 10.67,50.42 13.97,50.42 | 13.97,50.42 19.09,50.42 C26.1 19.22,52.07 C28.1 C27.1 C24.1 C25.1 | 13.97,50.42 21.21,41.91 31.88,41.91 31.75,29.21 T2.3 38.1,19.05 41.78,15.75 60.58,15.62 71.12,15.62 BISS0001.1
CS_3.3V  (via drill 0.6)
  Top 0.406: U5.P$12 47.81,50.29 v46.35,50.29 | v38.23,39.5 36.58,39.5 36.45,39.37 36.45,36.96 35.69,36.2 U3.12 | R24.1 44.83,33.22 v44.83,34.16
  Bottom 0.406: v46.35,50.29 41.91,50.29 38.23,46.61 v38.23,39.5 38.23,38.99 38.61,38.99 38.61,34.16 v44.83,34.16
EN_3.3V  (via drill 0.6)
  Top 0.406: U3.2 42.16,32.38 v42.16,40.51 | v37.59,57.66 37.64,57.66 U5.P$26
  Bottom 0.406: v42.16,40.51 42.16,49.4 47.5,49.4 47.5,57.53 47.37,57.4 45.47,57.4 43.94,55.88 43.18,55.88 41.53,57.53 37.59,57.53 v37.59,57.66
GND  (via drill 0.6)  (10 unrouted)
  Top 0.406: R6.1 61.66,25.54 C6.2
  Top 0.61: L1.2 18.03,58.89 L2.2 | R21.1 60.78,33.02 R22.2
  Bottom 0.61: C14.1 C13.1
  other vias: 71.12,20.32 49.53,36.83 54.61,10.16 66.04,11.43 21.59,16.51 15.24,7.62 5.08,19.05 29.21,55.88 44.45,38.1 50.8,55.88 66.04,38.1 60.83,30.48 44.45,3.81 13.97,27.94 7.62,43.18 60.2,25.53
  pour Top (isolate 0.305): 0,0 68.58,0 68.58,13.21 77.47,13.21 77.47,61.34 10.16,61.34 10.16,55.88 0,55.88
  pour Bottom (isolate 0.305): 0,0 68.58,0 68.58,13.21 77.85,12.95 77.85,61.09 10.16,61.34 10.16,55.88 0,55.88
IO3
  Top 0.406: R35.1 30.3,43.43 49.02,43.43 49.66,44.2 51.18,44.2 51.31,44.32 51.31,49.15 51.31,49.16 U6.1
IO4/TX  (via drill 0.6)
  Top 0.406: U3.9 35.56,40.39 35.56,41.53 48.9,41.53 v49.28,41.15 | v53.21,48.01 53.56,48.35 U6.2
  Bottom 0.406: v49.28,41.15 49.15,41.27 49.15,43.81 49.91,44.58 52.83,44.58 53.21,44.96 v53.21,48.01
IO5/RX  (via drill 0.6)
  Top 0.406: U3.14 v37.21,33.66 | v57.78,43.94 56.9,43.94 56.89,43.94 U6.9
  Bottom 0.406: v37.21,33.66 43.81,33.66 44.45,33.02 57.15,33.02 62.23,38.1 62.23,38.48 57.78,42.93 v57.78,43.94
IO6  (via drill 0.6)
  Top 0.406: R33.1 51.82,42.16 v52.07,41.91 | v58.29,39.88 58.29,40.01 57.66,40.64 57.66,42.03 U6.10
  Bottom 0.406: v52.07,41.91 56.26,41.91 v58.29,39.88
IO8/PIR_SIG
  Top 0.406: U6.12 59.29,36.04 R22.1 59.64,34.62 59.18,34.16 59.18,28.96 57.02,26.8 57.02,25.4 55.5,23.88 48.64,23.88 48.01,24.51 48.01,27.18 47.12,28.07 46.25,28.07 T1.2
IO9  (via drill 0.6)
  Top 0.406: R34.1 27.69,43.94 28.7,42.8 49.78,42.8 50.16,43.18 v50.55,43.18 | v60.71,38.35 60.09,38.97 U6.13
  Bottom 0.406: v50.55,43.18 50.55,41.02 52.07,39.37 56.9,39.37 58.17,38.1 60.45,38.1 v60.71,38.35
IO11/MOSI  (via drill 0.6)
  Top 0.406: v61.72,43.81 61.72,42.09 U6.15
  Bottom 0.406: U$8.4 70.87,54.86 69.47,56.26 66.55,56.26 66.17,55.88 66.17,51.69 v61.72,43.81
IO12/MISO  (via drill 0.6)
  Top 0.406: v62.61,39.75 62.61,41.94 U6.16
  Bottom 0.406: U$8.1 68.33,48.01 63.5,43.18 63.5,40.64 v62.61,39.75
IO13/SCK  (via drill 0.6)
  Top 0.406: U6.17 63.98,42.7 v64.77,41.91
  Bottom 0.406: v64.77,41.91 67.44,41.91 68.33,42.8 69.84,42.8 D2.A
  Bottom 0.61: U$8.3 70.87,43.8 D2.A
MOSI_3.3V  (via drill 0.6)
  Top 0.406: U5.P$15 47.73,53.98 v46.48,53.98 | v37.47,38.35 37.59,38.23 39.5,38.23 40.26,37.47 U3.6
  Bottom 0.406: v46.48,53.98 44.7,53.98 37.47,46.74 v37.47,38.35
N$1
  Top 0.406: R5.1 68.71,37.85 BISS0001.9
N$3
  Bottom 0.813: LED2.C R18.2
N$14
  Top 0.61: BISS0001.16 62.92,17.91 R2.1 62.22,19.37 C11.1 60.59,20.83 C15.1
N$15
  Top 0.61: R2.2 64.08,19.43 R7.2 64.02,22.16 C11.2 66.17,20.83 BISS0001.15
N$16
  Top 0.61: C12.1 62.22,28 R3.1 | R3.1 61.54,27.94 R4.2 | R3.1 62.28,27.38 62.87,26.8 64.01,26.8 65.28,25.53 BISS0001.13
N$17  (via drill 0.6)
  other vias: 63.5,53.34
N$19  (via drill 0.6)
  other vias: 29.21,48.26
N$20
  Bottom 0.813: LED1.C R20.2
N$22  (via drill 0.6)
  other vias: 12.7,53.34
N$26
  Top 0.61: C12.2 64.02,28 R3.2 66.42,27.94 BISS0001.12
N$27
  Top 0.61: R7.1 61.35,22.35 C8.1
N$32  (via drill 0.6)
  Top 0.813: U1.21 62.69,3.6 v61.98,4.57
  Bottom 0.813: v61.98,4.57 LED2.A
N$33  (via drill 0.6)
  Top 0.813: U1.22 63.89,3.43 v64.01,4.19
  Bottom 0.813: v64.01,4.19 63.88,5.46 R19.2
N$34  (via drill 0.6)
  Top 0.813: U1.19 60.29,3.85 v58.93,5.21
  Bottom 0.813: v58.93,5.21 LED1.A
N$35
  Top 0.61: BISS0001.10 64.08,33.15 R21.2
N$36
  Top 0.61: C15.2 58.16,23.69 R4.1
N$37
  Bottom 0.61: BISS0001.6 73.61,30.61 R10.2
N$38
  Bottom 0.61: R10.1 C13.2 71.62,30.11 73.53,28.19 74.04,28.19 BISS0001.5
N$39
  Bottom 0.61: R13.1 71.25,24.33 C14.2 71.39,25.53 BISS0001.4
N$40
  Bottom 0.61: BISS0001.3 73.71,22.53 R13.2
N$41
  Top 0.61: BISS0001.2 73.41,20.45 69.22,16.51 58.75,16.51 R8.2
N$42
  Top 0.61: R8.1 55.37,17.35 55.37,20.7 53.21,22.86 48.26,22.86 46.06,25.06 T1.1 46.19,26.46
N$43
  Top 0.61: U5.P$5 40.04,45.43 40.51,44.96 40.64,44.96 40.89,44.7 SJ1.2
N$44
  Top 0.61: U5.P$7 42.44,45.82 SJ1.1
N$45
  Top 0.61: U5.P$28 U5.P$27
N$46
  Top 0.61: U5.P$29 U5.P$30
N$47
  Top 0.61: C19.2 16.64,57.4 17.02,57.02 18.12,57.02 L2.1 20.95,57.06 C17.1
N$48
  Top 0.61: AE1.FEED 9.27,58.8 10.92,57.15 12.28,57.15 L1.1 14.18,57.19 C19.1
N$50
  Top 0.61: C17.2 23.11,57.02 32.51,47.62 33.34,47.62 U5.P$35
N$53
  Top 0.406: U6.8 55.5,43.45 55.5,41.53 57.02,40.01 57.02,29.34 55.96,28.27 U$7.P$2
  Top 0.61: U$7.P$2 54.61,25.91 C20.2 52.16,26.71 51.44,27.43 49.91,27.43 49.28,28.07 49.28,28.88 R25.1
N$54
  Top 0.406: U6.7 54.1,44.35 54.1,37.72 54.61,37.72 U$7.P$1
  Top 0.61: R25.2 50.76,29.07 C21.1 50.76,34.38 54.1,37.72
N$55
  Top 0.406: C23.1 66.97,47.16 65.79,45.97 64,45.97 U6.20
N$56
  Bottom 0.406: D2.C 72.35,41.03 R27.2
N$57
  Bottom 0.813: R29.P$2 1.52,46.86 0.89,47.75 0.89,49.66 1.91,50.55 5.33,50.55 6.86,49.02 8.51,49.02 U$9.C2
N$58
  Bottom 0.813: R31.P$2 3.81,48.64 3.81,46.99 8.18,46.99 U$9.C1
N$59
  Bottom 0.813: R28.P$2 8.18,53.59 U$9.C3
N$60
  Top 0.61: Q7.3 17.02,53.47 R28.P$1
N$61
  Top 0.61: Q6.3 19.18,49.66 R31.P$1
N$62
  Top 0.61: Q2.3 18.71,45.76 R29.P$1
N$63
  Top 0.61: R33.2 R36.2 21.16,44.78 Q2.1
N$64
  Top 0.61: R35.2 R38.2 27.05,45.54 27.05,50.55 25.08,52.52 Q7.1
N$65
  Top 0.61: R34.2 24.21,43.94 R37.2 24.08,48.21 Q6.1
N$68
  Top 0.813: U$11.26 28.79,34.29 C29.1
N$69
  Top 0.813: C29.2 28.36,30.9 U$11.22
N$70
  Top 0.813: U$11.1 3.81,38.92 U$12.P$2
  Bottom 0.813: R39.P$1 22.48,39.5 18.03,35.05 4.57,35.05 U$11.1
N$71
  Top 0.813: U$11.3 6.86,29.21 11.56,33.91 11.56,39.05 U$12.P$1 NEUTRAL1.1
N$72
  Top 0.813: LINE1.1 29.72,9.53 FUSE2.1
N$73
  Top 0.813: R39.P$2 27.69,24.26 FUSE1.1
RESET
  Top 0.406: U6.29 59.29,52.55 56.52,55.32
  Top 0.61: D3.A 56.52,55.32 R26.1
  Bottom 0.61: U$8.5 73.79,52.07 75.18,53.47 75.18,56.01 73.53,57.66 58.29,57.66 D3.A
RX
  Top 0.406: U1.13 52.84,2.03 48.13,2.03 47.5,2.67 47.5,17.65 41.91,23.24 40.89,23.24 38.1,26.04 33.66,26.04 32.64,26.92 32.64,31.62 33.27,32.26 U3.15
S  (via drill 0.6)
  Top 0.61: BISS0001.14 65.91,22.99 65.15,23.75 C6.1 61.66,23.74 R6.2 60.02,23.8 v59.69,24.13
  Bottom 0.61: T2.2 41.91,24.13 v59.69,24.13
SCK_3.3V  (via drill 0.6)
  Top 0.406: U5.P$17 47.72,56.39 v46.23,56.39 | v36.83,35.56 37.47,34.92 U3.4
  Bottom 0.406: v46.23,56.39 36.83,46.99 v36.83,35.56
TX
  Top 0.406: U1.14 54.23,1.72 54.1,0.51 47.24,0.51 46.74,1.02 46.74,17.4 41.53,22.61 40.77,22.61 38.1,25.27 33.27,25.27 31.88,26.67 31.88,37.47 33.15,38.73 U3.10